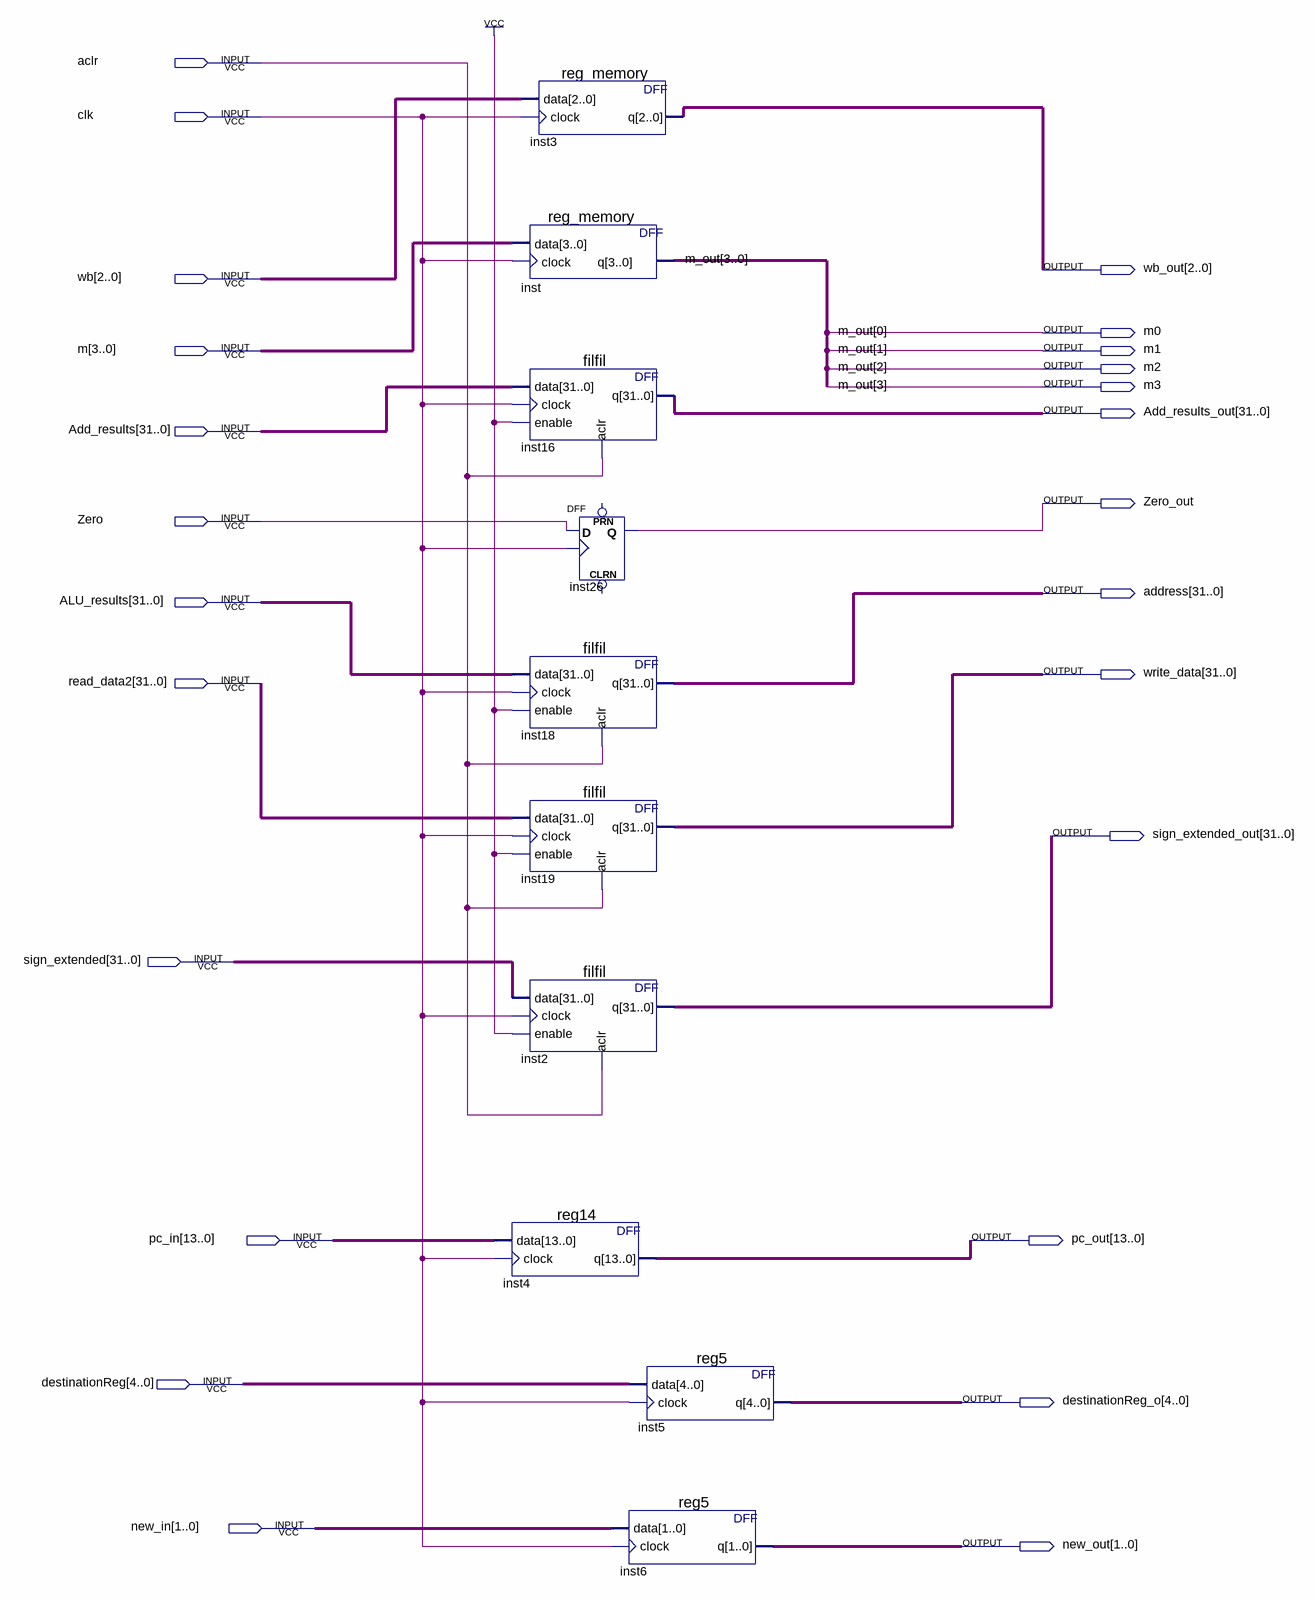
[diagram p0: schematic sheet]
// Quartus schematic EXMEM.bdf as structural Verilog: 10 symbols, 25 pins
module EXMEM (
  input  aclr,
  input  clk,
  input  [2:0] wb,
  input  [3:0] m,
  input  [31:0] Add_results,
  input  Zero,
  input  [31:0] ALU_results,
  input  [31:0] read_data2,
  input  [31:0] sign_extended,
  input  [13:0] pc_in,
  input  [4:0] destinationReg,
  input  [1:0] new_in,
  output [2:0] wb_out,
  output m0,
  output m1,
  output m2,
  output m3,
  output [31:0] Add_results_out,
  output Zero_out,
  output [31:0] address,
  output [31:0] write_data,
  output [31:0] sign_extended_out,
  output [13:0] pc_out,
  output [4:0] destinationReg_o,
  output [1:0] new_out
);

  reg_memory inst3 (.data(wb), .clock(clk), .q(wb_out));
  reg_memory inst (.data(m), .clock(clk), .q(m));
  filfil inst16 (.data(Add_results), .clock(clk), .enable(1'b1), .aclr(aclr), .q(Add_results_out));
  filfil inst18 (.data(ALU_results), .clock(clk), .enable(1'b1), .aclr(aclr), .q(address));
  filfil inst19 (.data(read_data2), .clock(clk), .enable(1'b1), .aclr(aclr), .q(write_data));
  filfil inst2 (.data(sign_extended), .clock(clk), .enable(1'b1), .aclr(aclr), .q(sign_extended_out));
  reg14 inst4 (.data(pc_in), .clock(clk), .q(pc_out));
  DFF inst26 (.CLK(clk), .D(Zero), .Q(Zero_out));  // open: CLRN, PRN
  reg5 inst5 (.data(destinationReg), .clock(clk), .q(destinationReg_o));
  reg5 inst6 (.data(new_in), .clock(clk), .q(new_out));

  assign m0 = m[0];
  assign m1 = m[1];
  assign m2 = m[2];
  assign m3 = m[3];

  // Other names for the same wires on the sheet: m_out[3:0] = m
endmodule
